# Altium schematic sheet ESP32.SchDoc
size A
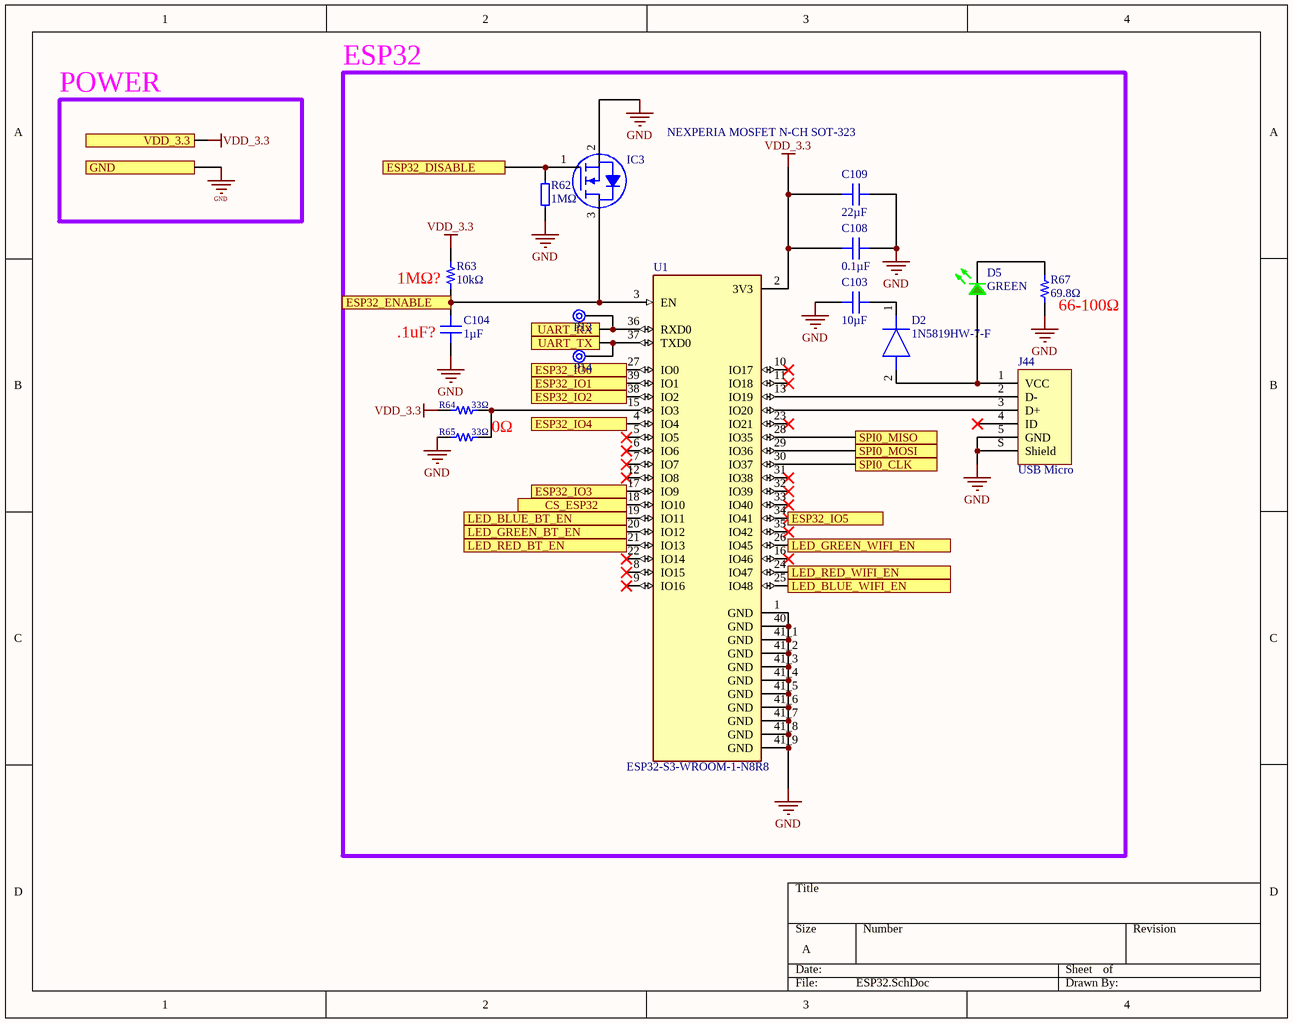
[diagram p0: ESP32.SchDoc]

## Parts
C103  10µF  [CAP 0603_1608]
C104  1µF  [CAP 0603_1608]
C108  0.1µF  [CAP 0603_1608 RF]
C109  22µF  [CAP 0805_2012]
D2  1N5819HW-7-F  [SOD3716X125N]
D5  GREEN  [LED 0603_1608]
IC3  NEXPERIA MOSFET N-CH SOT-323  [NEXPERIA SOT-323]
J44  USB Micro  [MICRO USB B]
P13  1 Pin  [1PINTHRU]  (value not drawn)
P14  1 Pin  [1PINTHRU]  (value not drawn)
R62  1MΩ  [0603_1608 RF]  (no BOM)
R63  10kΩ  [RES 0603_1608 RF]
R64  33Ω  [RES 0201_0603]
R65  33Ω  [RES 0201_0603]
R67  69.8Ω  [RES 0603_1608 RF]
U1  ESP32-S3-WROOM-1-N8R8  [XCVR_ESP32S3WROOM1N8R8]

## Ports
CS_ESP32, ESP32_DISABLE, ESP32_ENABLE, ESP32_IO0, ESP32_IO1, ESP32_IO2, ESP32_IO3, ESP32_IO4, ESP32_IO5, GND, LED_BLUE_BT_EN, LED_BLUE_WIFI_EN, LED_GREEN_BT_EN, LED_GREEN_WIFI_EN, LED_RED_BT_EN, LED_RED_WIFI_EN, SPI0_CLK, SPI0_MISO, SPI0_MOSI, UART_RX, UART_TX, VDD_3.3

## Nets
GND: C103.1 C104.1 C108.1 C109.2 IC3.2(S) J44.5(GND) J44.S(Shield) R62.2 R65.1 R67.1 U1.1(GND) U1.40(GND) U1.41_1(GND) U1.41_2(GND) U1.41_3(GND) U1.41_4(GND) U1.41_5(GND) U1.41_6(GND) U1.41_7(GND) U1.41_8(GND) U1.41_9(GND) ; port GND
VDD_3.3: C108.2 C109.1 R63.2 R64.1 U1.2(3V3) ; port VDD_3.3
CS_ESP32: U1.18(IO10) ; port CS_ESP32
ESP32_DISABLE: IC3.1(G) R62.1 ; port ESP32_DISABLE
ESP32_ENABLE: C104.2 IC3.3(D) R63.1 U1.3(EN) ; port ESP32_ENABLE
ESP32_IO0: U1.27(IO0) ; port ESP32_IO0
ESP32_IO1: U1.39(IO1) ; port ESP32_IO1
ESP32_IO2: U1.38(IO2) ; port ESP32_IO2
ESP32_IO3: U1.17(IO9) ; port ESP32_IO3
ESP32_IO4: U1.4(IO4) ; port ESP32_IO4
ESP32_IO5: U1.34(IO41) ; port ESP32_IO5
LED_BLUE_BT_EN: U1.19(IO11) ; port LED_BLUE_BT_EN
LED_BLUE_WIFI_EN: U1.25(IO48) ; port LED_BLUE_WIFI_EN
LED_GREEN_BT_EN: U1.20(IO12) ; port LED_GREEN_BT_EN
LED_GREEN_WIFI_EN: U1.26(IO45) ; port LED_GREEN_WIFI_EN
LED_RED_BT_EN: U1.21(IO13) ; port LED_RED_BT_EN
LED_RED_WIFI_EN: U1.24(IO47) ; port LED_RED_WIFI_EN
SPI0_CLK: U1.30(IO37) ; port SPI0_CLK
SPI0_MISO: U1.28(IO35) ; port SPI0_MISO
SPI0_MOSI: U1.29(IO36) ; port SPI0_MOSI
UART_RX: P13.1(PAD) U1.36(RXD0) ; port UART_RX
UART_TX: P14.1(PAD) U1.37(TXD0) ; port UART_TX
NetC103_2: C103.2 D2.1(K)
NetD2_2: D2.2(A) D5.1 J44.1(VCC)
NetD5_2: D5.2 R67.2
NetJ44_2: J44.2(D-) U1.13(IO19)
NetJ44_3: J44.3(D+) U1.14(IO20)
NetR64_2: R64.2 R65.2 U1.15(IO3)

Not connected (* = marked no-connect by the designer): J44 4(ID)*; U1 5(IO5)* 6(IO6)* 7(IO7)* 8(IO15)* 9(IO16)* 10(IO17)* 11(IO18)* 12(IO8)* 16(IO46)* 22(IO14)* 23(IO21)* 31(IO38)* 32(IO39)* 33(IO40)* 35(IO42)*

## Notes on the sheet
- POWER
- ESP32
- 1MΩ?
- (near C104) .1uF?
- (near R67) 66-100Ω
- 0Ω

## Library data of the parts
C103 = CAP00040: CAP CER 010UF 25V X7R 0603; Manufacturer: KEMET; Manufacturer P/N: C0603C273K3RACTU; Tolerance: ±10%; Device ID: CAP00040; Mounting Type: Surface Mount; Part Type: Capacitor; VALUE: 10µF; Operating Temperature: -55°C ~ 125°C; Voltage: 25V; Package: 0603 (1608 Metric); Supplier1: Digi-Key; Supplier1 P/N: 399-7891-1-ND; Supplier2: Mouser; Supplier2 P/N: 80-C0603C273K3R; Temperature Coefficient: X7R
C104 = CAP00007: CAP CER 1UF 10V X7R 0603; Manufacturer: KEMET; Manufacturer P/N: C0603C105K8RACTU; Tolerance: ±10%; Device ID: CAP00007; Mounting Type: Surface Mount; Part Type: Capacitor; VALUE: 1µF; Operating Temperature: -55°C ~ 125°C; Voltage: 10V; Package: 0603 (1608 Metric); Supplier1: Digi-Key; Supplier1 P/N: 399-11133-1-ND; Supplier2: Mouser; Supplier2 P/N: 80-C0603C105K8R; Temperature Coefficient: X7R
C108 = CAP00039: CAP CER 0.1UF 16V X7R 0603; Manufacturer: KEMET; Manufacturer P/N: C0603C104M4RACAUTO; Tolerance: ±20%; Device ID: CAP00039; Mounting Type: Surface Mount; Part Type: Capacitor; VALUE: 0.1µF; Operating Temperature: -55°C ~ 125°C; Voltage: 16V; Package: 0603 (1608 Metric); Supplier1: Digi-Key; Supplier1 P/N: 399-C0603C104M4RACAUTOCT-ND; Supplier2: Mouser; Supplier2 P/N: C0603C104M4RACAUTO; Temperature Coefficient: X7R
C109 = CAP0003F: CAP CER 22UF 10V X7R 0805; Manufacturer: Murata Electronics; Manufacturer P/N: GRM21BZ71A226ME15L; Tolerance: ±20%; Device ID: CAP0003F; Mounting Type: Surface Mount; Part Type: Capacitor; VALUE: 22µF; Operating Temperature: -55°C ~ 125°C; Voltage: 10V; Package: 0805 (2012 Metric); Supplier1: Digi-Key; Supplier1 P/N: 490-GRM21BZ71A226ME15LCT-ND; Supplier2: -; Supplier2 P/N: -; Temperature Coefficient: X7R
D2 = 1N5819HW-7-F: Diode; Manufacturer_Name: MULTICOMP; Height: 1.25mm; Manufacturer_Part_Number: 1N5819HW-7-F
D5 = LED0000B: LED RED CLEAR 0603 SMD; Manufacturer: Würth Elektronik; Manufacturer P/N: 150060RS75000; If - Forward Current: 100mA; Vf - Forward Voltage: 2.0V; Wavelength: 625nm; Viewing Angle: 140°; Lens Color: Colorless; Device ID: LED0000B; VALUE: GREEN; Mounting Type: Surface Mount; Part Type: LED; Operating Temperature: -40°C ~ 85°C; Package: 0603 (1608 Metric); Color: Red; Supplier1: Digi-Key; Supplier1 P/N: 732-4978-1-ND
IC3 = MOS00000: MOSFET N-CH 60V 320MA SOT323; Manufacturer: Nexperia USA Inc.; Manufacturer P/N: BSS138PW,115; FET Type: N-Channel; VALUE: NFET; Current - Continuous Drain (Id) @ 25°C: 320mA (Ta); Drive Voltage (Max Rds On, Min Rds On): 10V; Rds On (Max) @ Id, Vgs: 1.6Ohm @ 300mA, 10V; Vgs(th) (Max) @ Id: 1.5V @ 250µA; Vgs (Max): ±20V; Power Dissipation (Max): 260mW (Ta), 830mW (Tc); Gate Charge (Qg) (Max) @ Vgs: 0.8 nC @ 4.5 V; Input Capacitance (Ciss) (Max) @ Vds: 50 pF @ 10 V; Device ID: MOS00000; Package: SOT-323; Part Type: IC; Technology: MOSFET (Metal Oxide); FET Feature: -; Operating Temperature: -55°C ~ 150°C (TA); Mounting Type: Surface Mount; Drain to Source Voltage (Vdss): 60V; Supplier1: Digi-Key; Supplier1 P/N: 1727-1143-1-ND; Supplier2: Mouser; Supplier2 P/N: 771-BSS138PW115
J44 = USB MICRO B: Manufacturer: TE; Manufacturer P/N: 123; Device ID: CON00014; VALUE: 5-Pin Board-to-Cable; Connector Type: Center Strip Contacts; Style: Board to Board; Number of Positions: 9; Number of Positions Loaded: All; Pitch - Mating: 0.012" (0.30mm); Mounting Type: Surface Mount; Part Type: Header; Operating Temperature: -40°C ~ 105°C; Package: N/A; Contact Type: Pins; Fastening Type: -; Contact Finish - Mating: Tin; Insulation Color: -; Material Flammability Rating: -; Current Rating (Amps): -; Voltage Rating: -; Supplier1: Digi-Key; Supplier1 P/N: 1253-046844745002846+CT-ND; Supplier2: Mouser; Supplier2 P/N: 346-046844745002846+
P13 P14 = 1 THRU HOLE: Device ID: CON00017; VALUE: 1 Pin Thru; Connector Type: Center Strip Contacts; Style: Board to Board; Number of Positions: 1; Number of Positions Loaded: All; Mounting Type: Surface Mount; Part Type: Header; Package: N/A; Contact Type: Pins; Pitch - Mating: -; Fastening Type: -; Contact Finish - Mating: Tin; Insulation Color: -; Material Flammability Rating: -; Current Rating (Amps): -; Voltage Rating: -; Supplier1: -; Supplier1 P/N: -; Supplier2: -; Supplier2 P/N: -
R62 = RFP00002: 0603 RF Passive; VALUE: 0603; Device ID: RFP00002; Mounting Type: Surface Mount; Part Type: Passive
R63 = RES0001B: RES SMD 10K OHM 5% 1/10W 0603; Manufacturer: Vishay Dale; Manufacturer P/N: CRCW060310K0JNEA; Power: 0.100W; Device ID: RES0001B; VALUE: 10kΩ; Mounting Type: Surface Mount; Part Type: Resistor; Operating Temperature: -55°C ~ 155°C; Package: 0603 (1608 Metric); Tolerance: ±5%; Composition: Thick Film; Supplier1: Digi-Key; Supplier1 P/N: 541-10KGCT-ND; Supplier2: Mouser; Supplier2 P/N: 71-CRCW0603J-10K-E3
R64 R65 = RES0003A: RES SMD 33 OHM 1% 1/20W 0201; Manufacturer: Vishay Dale; Manufacturer P/N: CRCW020110R0FNED; Power: 0.050W; Device ID: RES0003A; VALUE: 33Ω; Mounting Type: Surface Mount; Part Type: Resistor; Operating Temperature: -55°C ~ 155°C; Package: 0201 (0603 Metric); Tolerance: ±1%; Composition: Thick Film; Supplier1: Digi-Key; Supplier1 P/N: 541-10.0ABCT-ND; Supplier2: Mouser; Supplier2 P/N: 71-CRCW020110R0FNED
R67 = RES00037: RES 69.8 OHM 1% 1/10W 0603; Manufacturer: Vishay Dale; Manufacturer P/N: ‎CRCW0603820KFKEAC‎; Power: 0.100W; Device ID: RES00037; VALUE: 69.8Ω; Mounting Type: Surface Mount; Part Type: Resistor; Operating Temperature: -55°C ~ 155°C; Package: 0603 (1608 Metric); Tolerance: ±1%; Composition: Thick Film; Supplier1: Digi-Key; Supplier1 P/N: ‎541-5568-1-ND‎; Supplier2: Mouser; Supplier2 P/N: 71-CRCW0603820KFKEAC
U1 = ESP32-S3-WROOM-1-N8R8: Bluetooth, WiFi 802.11b/g/n, Bluetooth v5.0 Transceiver Module 2.4GHz PCB Trace Surface Mount; MF: Espressif Systems; Price: None; Availability: In Stock; Package: None; MP: ESP32-S3-WROOM-1-N8R8; Value: *; SnapEDA_Link: https://www.snapeda.com/parts/ESP32-S3-WROOM-1-N8R8/Espressif+Systems/view-part/?ref=snap; Check_prices: https://www.snapeda.com/parts/ESP32-S3-WROOM-1-N8R8/Espressif+Systems/view-part/?ref=eda; Purchase-URL: https://pricing.snapeda.com/search/part/ESP32-S3-WROOM-1-N8R8/?ref=eda